# EAGLE design ESPCAT (EAGLE 8.0.1)
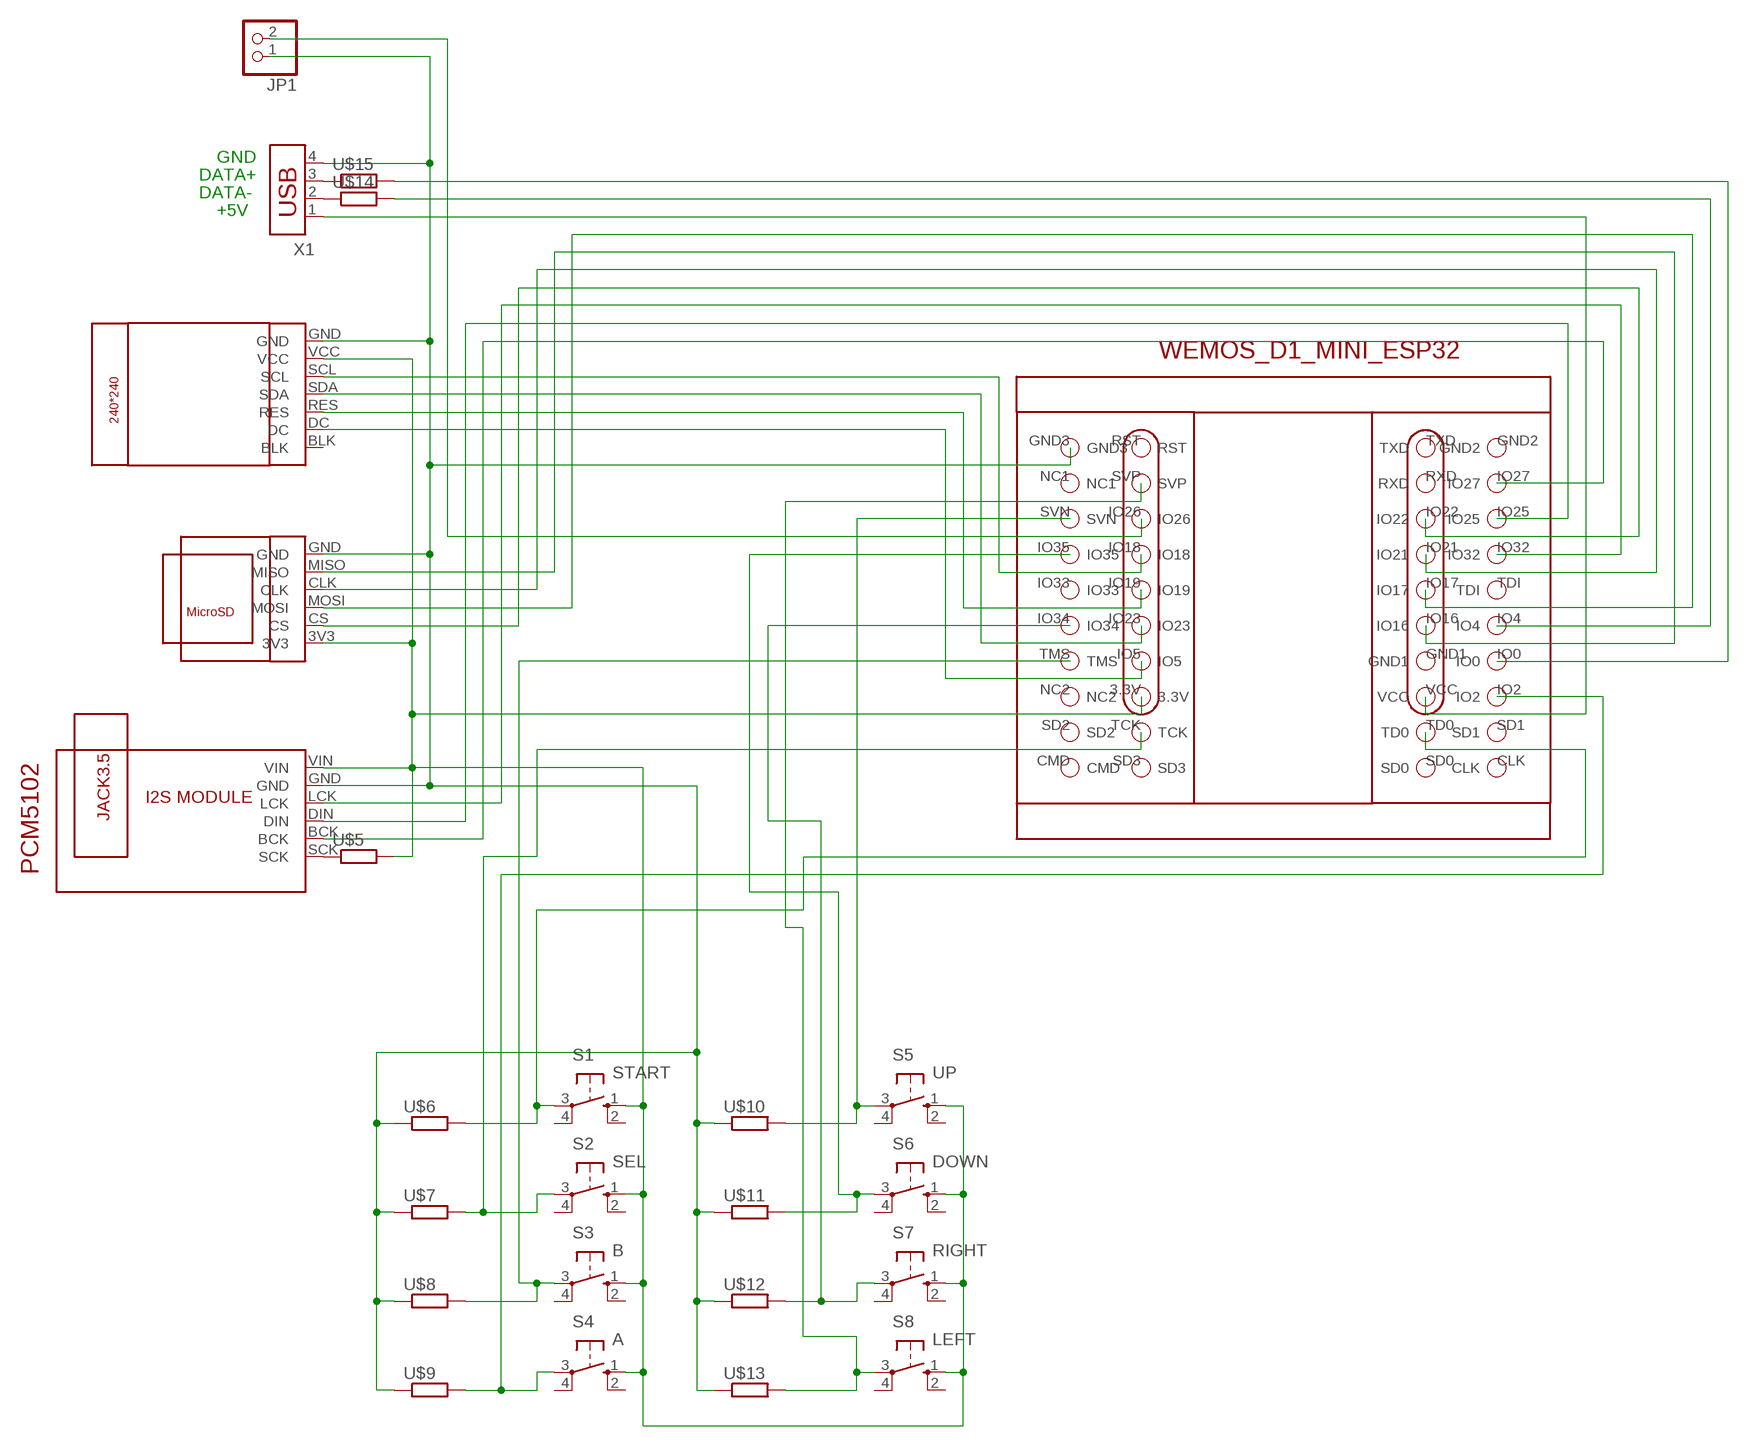
[diagram p0: schematic, sheet 1]

## Parts
JP1  PINHD-1X2/90  [1X02/90]
S1  START  10-XX  [B3F-10XX]
S2  SEL  10-XX  [B3F-10XX]
S3  B  10-XX  [B3F-10XX]
S4  A  10-XX  [B3F-10XX]
S5  UP  10-XX  [B3F-10XX]
S6  DOWN  10-XX  [B3F-10XX]
S7  RIGHT  10-XX  [B3F-10XX]
S8  LEFT  10-XX  [B3F-10XX]
U$1  WEMOS_D1_MINI_ESP32  [WEMOS_D1_MINI_ESP32]
U$2  ST7789-1.3INCH  [ST7789-1.3INCH]
U$3  MICROSD-CARD-MODULE  [MICROSD-CARD-MODULE]
U$4  I2S-MODULE-PCM5102A-LITE  [I2S-MODULE-PCM5102A-LITE]
U$5  R-RESISTORR-0207/10H  [R-0207/10H]
U$6  R-RESISTORR-0207/10H  [R-0207/10H]
U$7  R-RESISTORR-0207/10H  [R-0207/10H]
U$8  R-RESISTORR-0207/10H  [R-0207/10H]
U$9  R-RESISTORR-0207/10H  [R-0207/10H]
U$10  R-RESISTORR-0207/10H  [R-0207/10H]
U$11  R-RESISTORR-0207/10H  [R-0207/10H]
U$12  R-RESISTORR-0207/10H  [R-0207/10H]
U$13  R-RESISTORR-0207/10H  [R-0207/10H]
U$14  R-RESISTORR-0207/10H  [R-0207/10H]
U$15  R-RESISTORR-0207/10H  [R-0207/10H]
X1  USB-787616  [USB]

## Nets
N$3: U$1.IO32 U$4.LCK
N$5: U$4.SCK U$5.1
N$6: JP1.2 U$1.IO26
N$7: U$14.1 X1.2
N$8: U$15.1 X1.3
N$10: U$1.VCC X1.1
N$12: S4.3(P) U$1.IO2 U$9.2
N$13: U$1.IO27 U$4.BCK
N$15: S1.1(S) S2.1(S) S3.1(S) S4.1(S) S5.1(S) S6.1(S) S7.1(S) S8.1(S) U$1.3.3V U$2.VCC U$3.3V3 U$4.VIN U$5.2
N$17: U$1.IO25 U$4.DIN
N$18: U$1.IO18 U$2.SCL
N$19: U$1.IO23 U$2.SDA
N$20: U$1.IO19 U$2.RES
N$21: S5.3(P) U$1.SVN U$10.2
N$22: S2.3(P) U$1.TCK U$7.2
N$24: S3.3(P) U$1.TMS U$8.2
N$63: U$1.IO5 U$2.DC
N$64: U$1.IO22 U$3.CS
N$65: U$1.IO21 U$3.CLK
N$66: S6.3(P) U$1.IO35 U$11.2
N$67: U$1.IO16 U$3.MISO
N$68: S1.3(P) U$1.TD0 U$6.2
N$69: U$1.IO17 U$3.MOSI
N$70: U$1.IO4 U$14.2
N$71: U$1.IO0 U$15.2
N$72: S8.3(P) U$1.SVP U$13.2
N$73: S7.3(P) U$1.IO34 U$12.2
N$77: JP1.1 U$1.GND3 U$2.GND U$3.GND U$4.GND U$6.1 U$7.1 U$8.1 U$9.1 U$10.1 U$11.1 U$12.1 U$13.1 X1.4
Unconnected: S1.2(S1) S1.4(P1) S2.2(S1) S2.4(P1) S3.2(S1) S3.4(P1) S4.2(S1) S4.4(P1) S5.2(S1) S5.4(P1) S6.2(S1) S6.4(P1) S7.2(S1) S7.4(P1) S8.2(S1) S8.4(P1) U$1.CLK U$1.CMD U$1.GND1 U$1.GND2 U$1.IO33 U$1.NC1 U$1.NC2 U$1.RST U$1.RXD U$1.SD0 U$1.SD1 U$1.SD2 U$1.SD3 U$1.TDI U$1.TXD U$2.BLK

## Notes on the sheet
- GND
- DATA+
- DATA-
- +5V

## Library data of the parts
JP1 = pinhead:PINHD-1X2: PIN HEADER
S1-S8 = switch-omron:10-XX: OMRON SWITCH; MPN: B3F-1000; OC_FARNELL: 176432; OC_NEWARK: 36M3542
U$1 = wemos_D1_mini_ESP32:WEMOS_D1_MINI_ESP32
U$2 = ST7789-1.3INCH:ST7789-1.3INCH
U$3 = MICROSD-CARD-MODULE:MICROSD-CARD-MODULE
U$4 = I2S-MODULE-PCM5102A:I2S-MODULE-PCM5102A-LITE
U$5-U$15 = NCX-LIB:R-RESISTOR
X1 = con-amp:USB-787616: AMP connector

## Board
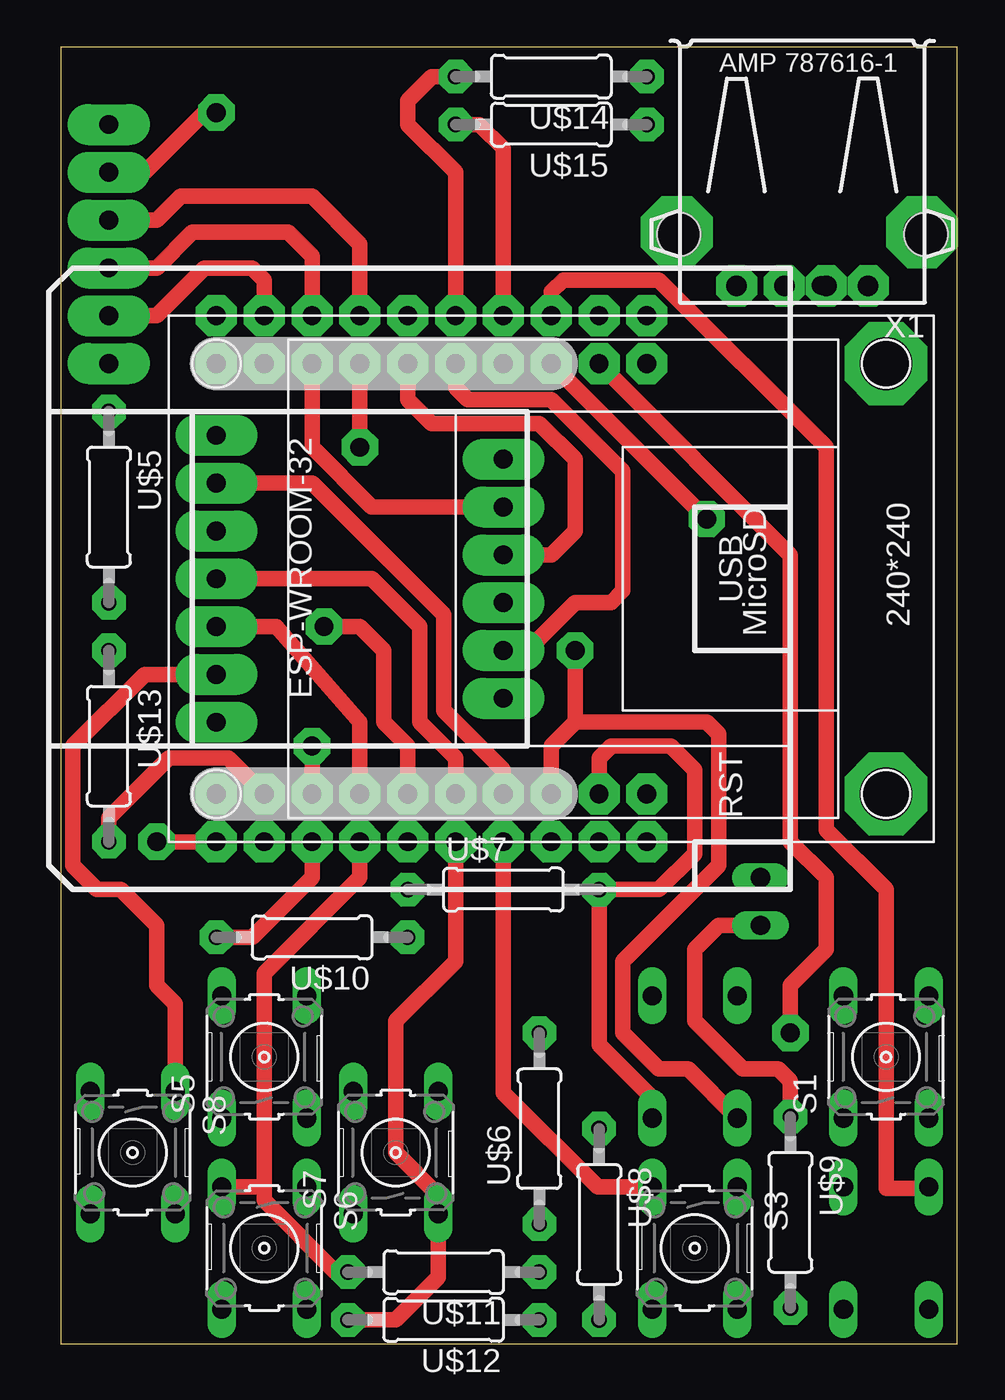
[diagram p1: board, top side]
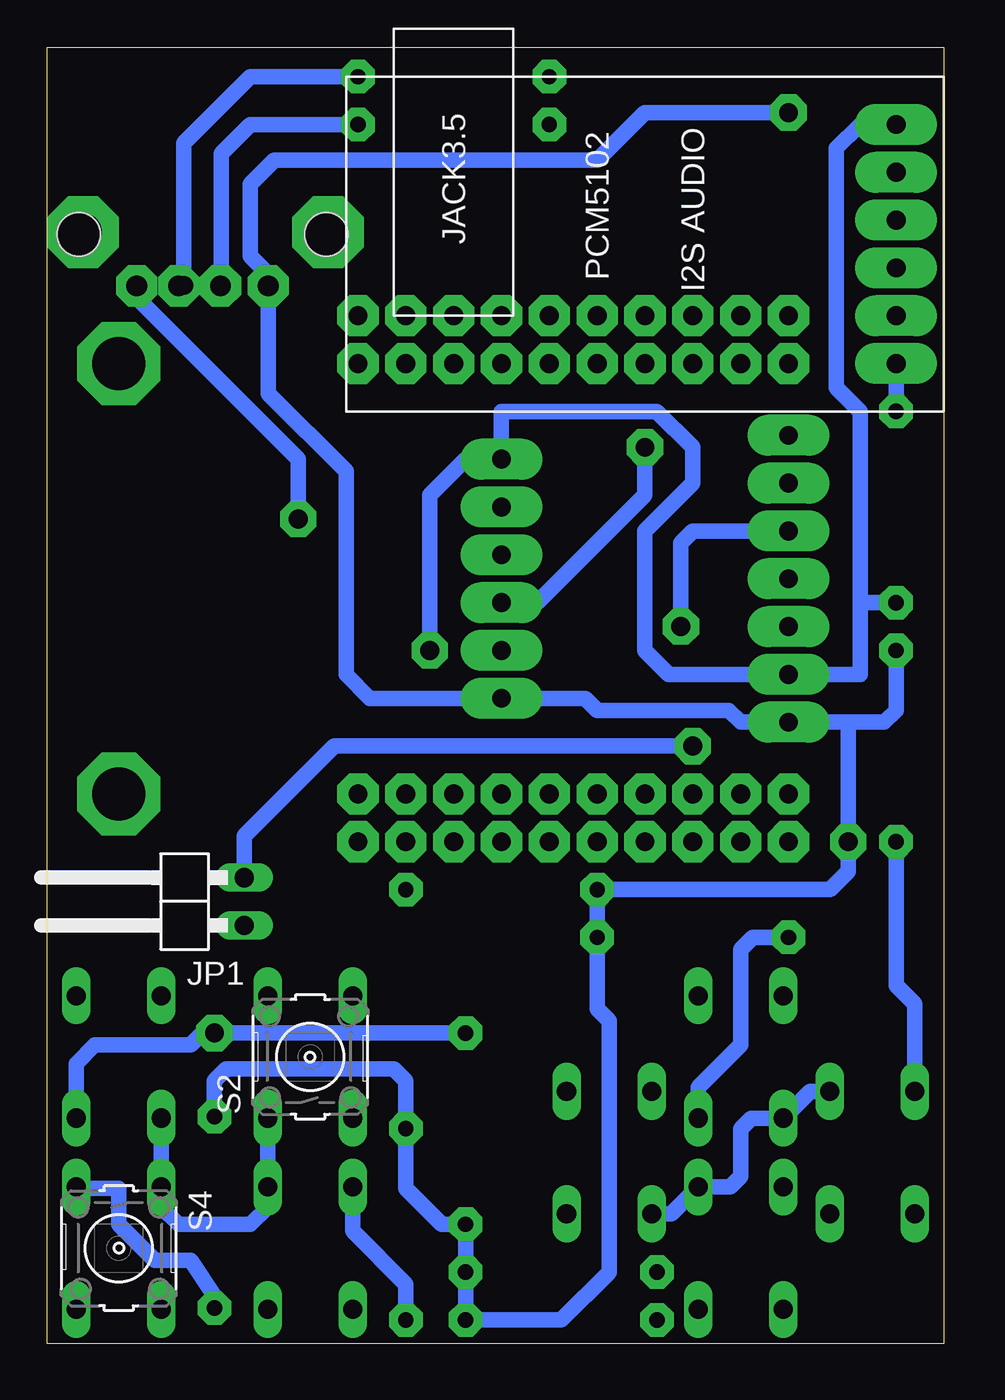
[diagram p2: board, bottom side, seen from below]

Size 47.6 x 68.89 mm. Coordinates in mm from the lower left corner, seen from the top.
Outline: 0,0 47.6,0 47.6,68.89 0,68.89 0,0
Copper layers (1*16): Top 0.035mm / dielectric 1.5mm / Bottom 0.035mm
Design rules "default": minimum track width 10mil, minimum drill 24mil, track to track 8mil, track to pad 8mil, pad to pad 8mil, via to via 8mil, smd to smd 8mil, copper to edge 40mil, drill to drill 8mil, minimum pad ring 10mil, minimum via ring 8mil, stop-mask expansion 4mil, vias tented up to drill 0mil, thermal gap 10mil

### Footprints (pad centres in the part's own frame; a part is rotated, then mirrored left to right if it is on the bottom)
1X02/90 = drill 1.016 long: 1 -1.27,-3.81; 2 1.27,-3.81
B3F-10XX = drill 1.016 long: 1 -3.251,2.261; 2 3.251,2.261; 3 -3.251,-2.261; 4 3.251,-2.261
WEMOS_D1_MINI_ESP32 = drill 1 pad 1.676 octagon: 3.3V -11.43,-10.16; CLK 13.97,-15.24; CMD -13.97,-15.24; GND1 11.43,-7.62; GND2 13.97,7.62; GND3 -13.97,7.62; IO0 13.97,-7.62; IO2 13.97,-10.16; IO4 13.97,-5.08; IO5 -11.43,-7.62; IO16 11.43,-5.08; IO17 11.43,-2.54; IO18 -11.43,0; IO19 -11.43,-2.54; IO21 11.43,0; IO22 11.43,2.54; IO23 -11.43,-5.08; IO25 13.97,2.54; IO26 -11.43,2.54; IO27 13.97,5.08; IO32 13.97,0; IO33 -13.97,-2.54; IO34 -13.97,-5.08; IO35 -13.97,0; NC1 -13.97,5.08; NC2 -13.97,-10.16; RST -11.43,7.62; RXD 11.43,5.08; SD0 11.43,-15.24; SD1 13.97,-12.7; SD2 -13.97,-12.7; SD3 -11.43,-15.24; SVN -13.97,2.54; SVP -11.43,5.08; TCK -11.43,-12.7; TD0 11.43,-12.7; TDI 13.97,-2.54; TMS -13.97,-7.62; TXD 11.43,7.62; VCC 11.43,-10.16
ST7789-1.3INCH = drill 1 pad 2.184 long: BLK -7.62,-19.05; DC -5.08,-19.05; GND 7.62,-19.05; RES -2.54,-19.05; SCL 2.54,-19.05; SDA 0,-19.05; VCC 5.08,-19.05
MICROSD-CARD-MODULE = drill 1 pad 2.184 long: 3V3 -6.35,-10.16; CLK 1.27,-10.16; CS -3.81,-10.16; GND 6.35,-10.16; MISO 3.81,-10.16; MOSI -1.27,-10.16
I2S-MODULE-PCM5102A-LITE = drill 1 pad 2.184 long: BCK -3.81,-13.335; DIN -1.27,-13.335; GND 3.81,-13.335; LCK 1.27,-13.335; SCK -6.35,-13.335; VIN 6.35,-13.335
R-0207/10H = drill 0.813 pad 1.778 octagon: 1 -5.08,0; 2 5.08,0
USB = drill 1: 1 -3.5,12.99; 2 -1,12.99; 3 1,12.99; 4 3.5,12.99 | hole 2.3: -6.57,10.28; 6.57,10.28

### Placement (x,y rotation side)
JP1  40.96,23.5 90 bottom
S1  43.81,15.24 90 top
S2  33.66,15.24 90 bottom
S3  33.66,5.08 270 top
S4  43.81,5.08 270 bottom
S5  10.79,15.24 90 top
S6  10.79,5.08 270 top
S7  17.78,10.16 90 top
S8  3.81,10.16 270 top
U$1  15.88,40.64 90 top
U$2  27.3,40.64 270 top
U$3  33.66,40.64 270 top
U$4  15.88,58.42 90 bottom
U$5  2.54,44.45 270 top
U$6  25.4,11.43 90 top
U$7  23.5,24.13 0 top
U$8  28.57,6.35 270 top
U$9  38.73,6.99 270 top
U$10  13.34,21.59 180 top
U$11  20.32,3.81 180 top
U$12  20.32,1.27 180 top
U$13  2.54,31.75 270 top
U$14  26.04,67.31 180 top
U$15  26.04,64.77 180 top
X1  39.37,69.22 180 top

### Tracks (layer width: path | path; a pad name or v marks a point on that pad's centre or on a via)
N$1  (via drill 2 pad 3.81)
  other vias: 45.72,59.05
N$2  (via drill 1.1 pad 2.18)
  other vias: 35.88,56.2
N$3
  Top 0.813: U$4.LCK 5.08,59.69 6.35,60.96 13.34,60.96 15.88,58.42 U$1.IO32
N$4  (via drill 1.1 pad 2.18)
  other vias: 38.42,56.2
N$5
  Bottom 0.813: U$5.1 U$4.SCK
N$6  (via drill 1 pad 1.93)
  Top 0.813: v13.34,31.75 U$1.IO26
  Bottom 0.813: JP1.2 37.15,26.99 32.38,31.75 v13.34,31.75
N$7
  Bottom 0.813: X1.2 40.37,63.77 36.83,67.31 U$14.1
N$8
  Bottom 0.813: X1.3 38.37,63.23 36.83,64.77 U$15.1
N$9  (via drill 1.1 pad 2.18)
  other vias: 42.86,56.2
N$10  (via drill 1 pad 1.93)
  Top 0.813: v34.29,43.81 U$1.VCC
  Bottom 0.813: X1.1 42.87,55.57 34.29,46.99 v34.29,43.81
N$12
  Top 0.813: U$1.IO2 26.04,55.88 26.67,56.52 31.75,56.52 40.64,47.62 40.64,27.3 43.81,24.13 43.81,8.26 46,8.26 S4.3
  Bottom 0.813: U$9.2 38.73,2.54 40.01,4.45 41.91,4.45 43.81,6.35 43.81,8.26 46,8.26 S4.3
N$13
  Top 0.813: U$4.BCK 5.08,54.61 7.62,57.15 10.16,57.15 10.79,56.52 U$1.IO27
N$14  (via drill 1 pad 2.18)
  other vias: 8.26,52.07
N$15  (via drill 1 pad 1.93)
  Top 0.813: U$2.VCC 4.45,35.56 0.64,31.75 0.64,25.4 1.91,24.13 3.17,24.13 5.08,22.23 5.08,19.05 6.07,18.06 S8.1 | 27.3,33.02 v27.3,36.83 | 27.3,33.02 26.04,31.75 U$1.3.3V | S2.1 33.3,14.61 31.75,14.61 29.84,16.51 29.84,20.32 34.92,25.4 34.92,32.38 34.29,33.02 27.3,33.02
  Bottom 0.813: U$4.VIN 4.45,64.77 5.71,63.5 5.71,50.8 4.45,49.53 4.45,39.37 | 4.45,39.37 4.45,35.56 U$2.VCC 14.61,35.56 15.88,36.83 15.88,43.18 13.34,45.72 13.34,47.62 15.24,49.53 23.5,49.53 U$3.3V3 25.4,46.99 27.3,45.09 v27.3,36.83 | U$5.2 4.45,39.37 | S8.1 7.11,13.41 S5.1 10.24,11.99 10.79,11.43 10.79,8.89 11.35,8.33 S6.1 14.48,6.91 S7.1 | S2.1 S3.1 35.92,7.26 36.83,6.35 40.64,6.35 41.55,7.26 S4.1 S1.1
N$16  (via drill 1 pad 2.18)
  other vias: 10.79,52.07
N$17
  Top 0.813: U$4.DIN 5.08,57.15 6.99,59.05 12.06,59.05 13.34,57.78 U$1.IO25
N$18
  Top 0.813: U$2.SCL 11.43,38.1 15.88,33.02 U$1.IO18
N$19
  Top 0.813: U$2.SDA 16.51,40.64 19.05,38.1 19.05,33.02 20.95,31.11 U$1.IO23
N$20  (via drill 1 pad 1.93)
  Top 0.813: v13.97,38.1 15.88,38.1 17.14,36.83 17.14,33.02 18.41,31.75 U$1.IO19
  Bottom 0.813: v13.97,38.1 13.97,42.55 13.34,43.18 U$2.RES
N$21
  Top 0.813: U$10.2 10.16,21.59 13.34,24.77 U$1.SVN
  Bottom 0.813: S5.3 13.06,13.61 10.79,15.88 10.79,20.95 10.16,21.59 U$10.2
N$22
  Top 0.813: U$1.TCK 28.57,31.11 29.21,31.75 32.38,31.75 33.66,30.48 33.66,26.04 31.75,24.13 U$7.2 28.57,15.88 31.39,13.06 S2.3
N$23  (via drill 1.1 pad 2.18)
  other vias: 40.64,56.2
N$24
  Top 0.813: S3.3 28.5,8.33 23.5,13.34 U$1.TMS
  Bottom 0.813: U$8.2 28.57,3.17 31.39,5.99 S3.3
N$25  (via drill 1 pad 2.18)
  other vias: 8.26,54.61
N$26  (via drill 1 pad 2.18)
  other vias: 10.79,54.61
N$27  (via drill 1 pad 2.18)
  other vias: 13.34,52.07
N$28  (via drill 1 pad 2.18)
  other vias: 13.34,54.61
N$29  (via drill 1 pad 2.18)
  other vias: 15.88,52.07
N$30  (via drill 1 pad 2.18)
  other vias: 15.88,54.61
N$31  (via drill 1 pad 2.18)
  other vias: 18.41,52.07
N$32  (via drill 1 pad 2.18)
  other vias: 18.41,54.61
N$33  (via drill 1 pad 2.18)
  other vias: 20.95,52.07
N$34  (via drill 1 pad 2.18)
  other vias: 20.95,54.61
N$35  (via drill 1 pad 2.18)
  other vias: 23.5,52.07
N$36  (via drill 1 pad 2.18)
  other vias: 23.5,54.61
N$37  (via drill 1 pad 2.18)
  other vias: 26.04,52.07
N$39  (via drill 1 pad 2.18)
  other vias: 28.57,52.07
N$40  (via drill 1 pad 2.18)  (1 unrouted)
  other vias: 28.57,54.61 26.04,54.61
N$41  (via drill 1 pad 2.18)
  other vias: 31.11,52.07
N$42  (via drill 1 pad 2.18)
  other vias: 31.11,54.61
N$43  (via drill 1 pad 2.18)
  other vias: 8.26,29.21
N$44  (via drill 1 pad 2.18)
  other vias: 8.26,26.67
N$45  (via drill 1 pad 2.18)
  other vias: 10.79,26.67
N$46  (via drill 1 pad 2.18)
  Top 0.813: v10.79,29.21 10.79,29.84
N$47  (via drill 1 pad 2.18)
  other vias: 13.34,29.21
N$48  (via drill 1 pad 2.18)
  other vias: 13.34,26.67
N$49  (via drill 1 pad 2.18)
  other vias: 15.88,26.67
N$50  (via drill 1 pad 2.18)
  other vias: 15.88,29.21
N$51  (via drill 1 pad 2.18)
  other vias: 18.41,26.67
N$52  (via drill 1 pad 2.18)
  other vias: 18.41,29.21
N$53  (via drill 1 pad 2.18)
  other vias: 20.95,26.67
N$54  (via drill 1 pad 2.18)
  other vias: 20.95,29.21
N$55  (via drill 1 pad 2.18)
  other vias: 23.5,26.67
N$56  (via drill 1 pad 2.18)
  other vias: 23.5,29.21
N$57  (via drill 1 pad 2.18)
  other vias: 26.04,26.67
N$58  (via drill 1 pad 2.18)
  other vias: 26.04,29.21
N$59  (via drill 1 pad 2.18)
  other vias: 28.57,26.67
N$60  (via drill 1 pad 2.18)
  other vias: 28.57,29.21
N$61  (via drill 1 pad 2.18)
  other vias: 31.11,26.67
N$62  (via drill 1 pad 2.18)
  other vias: 31.11,29.21
N$63
  Top 0.813: U$2.DC 13.34,45.72 20.32,38.73 20.32,33.66 23.5,30.48 U$1.IO5
N$64
  Top 0.813: U$3.CS 16.51,44.45 13.34,47.62 U$1.IO22
N$65  (via drill 1 pad 1.93)
  Top 0.813: v15.88,47.62 U$1.IO21
  Bottom 0.813: U$3.CLK 21.59,39.37 15.88,45.09 v15.88,47.62
N$66
  Top 0.813: U$11.2 14.61,3.81 10.79,7.62 10.79,8.26 | 10.79,8.26 10.79,19.68 15.88,24.77 U$1.IO35 | S6.3 10.72,8.33 10.79,8.26
N$67
  Top 0.813: U$3.MISO 24.77,36.83 27.3,39.37 29.21,39.37 29.84,40.01 29.84,46.35 26.04,50.16 21.59,50.16 20.95,50.8 U$1.IO16
N$68  (via drill 1 pad 1.93)
  Top 0.813: U$1.TD0 38.73,41.91 38.73,26.67 40.64,24.77 40.64,20.95 38.73,19.05 v38.73,16.51
  Bottom 0.813: S1.3 46.08,14.88 45.09,15.88 40.01,15.88 39.37,16.51 v38.73,16.51 U$6.2
N$69
  Top 0.813: U$3.MOSI 26.04,41.91 27.3,43.18 27.3,46.99 25.4,48.9 19.68,48.9 18.41,50.16 U$1.IO17
N$70
  Top 0.813: U$14.2 19.68,67.31 18.41,66.04 18.41,64.77 20.95,62.23 U$1.IO4
N$71
  Top 0.813: U$15.2 22.23,64.77 23.5,63.5 U$1.IO0
N$72
  Top 0.813: U$13.2 2.54,27.94 5.71,31.11 8.89,31.11 U$1.SVP
  Bottom 0.813: U$13.2 2.54,19.05 1.55,18.06 S8.3
N$73
  Top 0.813: U$12.2 17.78,1.27 20.04,3.53 S7.3 20.04,7.9 17.78,10.16 17.78,17.14 20.95,20.32 U$1.IO34
N$74  (via drill 2.8 pad 4.4)
  other vias: 43.81,52.07
N$75  (via drill 2.8 pad 4.4)
  other vias: 43.81,29.21
N$76  (via drill 2 pad 3.81)
  other vias: 32.7,59.05
N$77  (via drill 1 pad 1.93)
  Top 0.813: v8.26,65.41 7.62,65.41 4.45,62.23 U$4.GND | JP1.1 34.92,22.23 33.66,20.95 33.66,17.14 36.2,14.61 38.1,14.61 38.73,13.97 U$9.1 | v5.08,26.67 U$1.GND3
  Bottom 0.813: v8.26,65.41 15.88,65.41 18.41,62.87 35.56,62.87 36.83,61.59 36.83,57.78 35.87,56.83 X1.4 35.87,50.48 31.75,46.35 31.75,35.56 30.48,34.29 U$3.GND 19.05,34.29 18.41,33.66 11.43,33.66 10.79,33.02 U$2.GND 5.08,33.02 | 5.08,33.02 3.17,33.02 2.54,33.66 U$13.1 | U$9.1 38.73,13.97 38.1,14.61 29.21,14.61 28.57,13.97 U$8.1 28.57,8.26 26.67,6.35 U$6.1 U$11.1 U$12.1 20.32,1.27 17.78,3.81 17.78,17.14 18.41,17.78 U$10.1 U$7.1 6.03,24.13 5.08,25.08 v5.08,26.67 5.08,33.02